# Altium schematic sheet A3000_Backplane.SchDoc
size A3; SheetNumber: 1; SheetTotal: 1
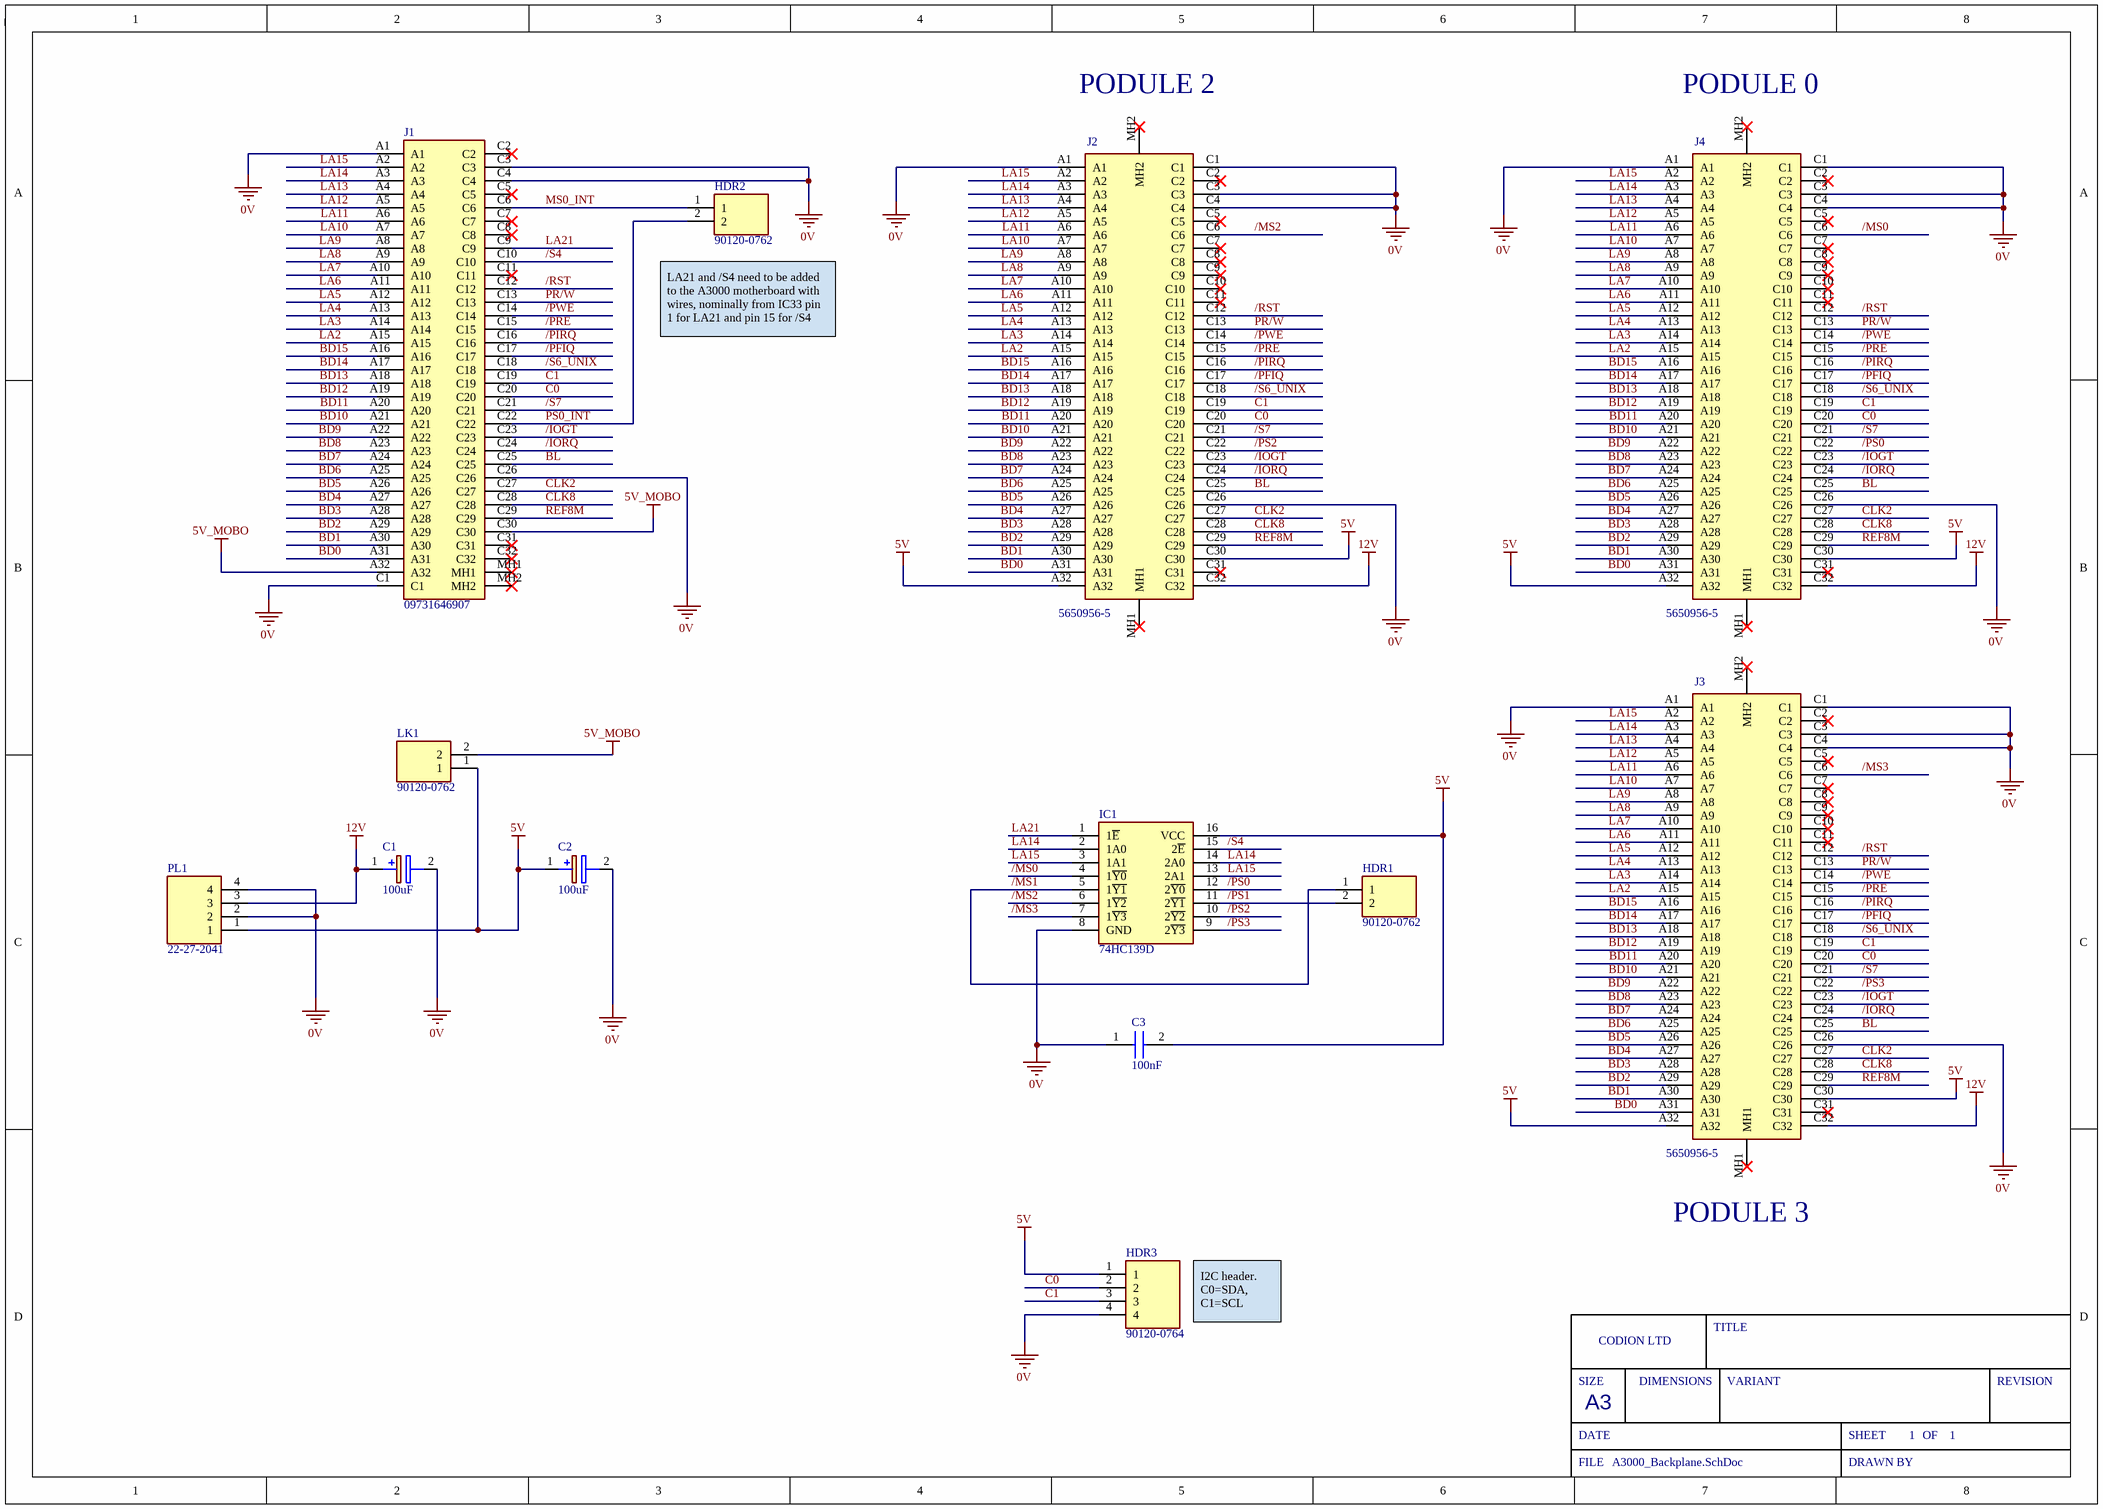
[diagram p0: A3000_Backplane.SchDoc]

## Parts
C1  100uF  [EEE0JA331XP]
C2  100uF  [EEE0JA331XP]
C3  100nF  [CAPC2012X145N]
HDR1  90120-0762  [HDRV2W35P0X254_1X2_508X249X560P]
HDR2  90120-0762  [HDRV2W35P0X254_1X2_508X249X560P]
HDR3  90120-0764  [HDRV4W90P0X254_1X4_994X249X560P]
IC1  74HC139D  [SOIC127P600X175-16N]
J1  09731646907  [56509455]
J2  5650956-5  [56509565]
J3  5650956-5  [56509565]
J4  5650956-5  [56509565]
LK1  90120-0762  [HDRV2W35P0X254_1X2_508X249X560P]
PL1  22-27-2041  [SHDR4W64P0X254_1X4_1016X580X1170P]

## Nets
0V: C1.2(-) C2.2(-) C3.1 HDR3.4 IC1.8(GND) J1.A1 J1.C1 J1.C3 J1.C4 J1.C26 J2.A1 J2.C1 J2.C3 J2.C4 J2.C26 J3.A1 J3.C1 J3.C3 J3.C4 J3.C26 J4.A1 J4.C1 J4.C3 J4.C4 J4.C26 PL1.2 PL1.4
5V: C2.1(+) C3.2 HDR3.1 IC1.16(VCC) J2.A32 J2.C30 J3.A32 J3.C30 J4.A32 J4.C30 LK1.1 PL1.1
5V_MOBO: J1.A32 J1.C30 LK1.2
12V: C1.1(+) J2.C32 J3.C32 J4.C32 PL1.3
/IOGT: J1.C23 J2.C23 J3.C23 J4.C23
/IORQ: J1.C24 J2.C24 J3.C24 J4.C24
/MS0: IC1.4(1~{Y0}) J4.C6
/MS1: HDR1.1 IC1.5(1~{Y1})
/MS2: IC1.6(1~{Y2}) J2.C6
/MS3: IC1.7(1~{Y3}) J3.C6
/PFIQ: J1.C17 J2.C17 J3.C17 J4.C17
/PIRQ: J1.C16 J2.C16 J3.C16 J4.C16
/PRE: J1.C15 J2.C15 J3.C15 J4.C15
/PS0: IC1.12(2~{Y0}) J4.C22
/PS1: HDR1.2 IC1.11(2~{Y1})
/PS2: IC1.10(2~{Y2}) J2.C22
/PS3: IC1.9(2~{Y3}) J3.C22
/PWE: J1.C14 J2.C14 J3.C14 J4.C14
/RST: J1.C12 J2.C12 J3.C12 J4.C12
/S4: IC1.15(2~{E}) J1.C10
/S6_UNIX: J1.C18 J2.C18 J3.C18 J4.C18
/S7: J1.C21 J2.C21 J3.C21 J4.C21
BD0: J1.A31 J2.A31 J3.A31 J4.A31
BD1: J1.A30 J2.A30 J3.A30 J4.A30
BD2: J1.A29 J2.A29 J3.A29 J4.A29
BD3: J1.A28 J2.A28 J3.A28 J4.A28
BD4: J1.A27 J2.A27 J3.A27 J4.A27
BD5: J1.A26 J2.A26 J3.A26 J4.A26
BD6: J1.A25 J2.A25 J3.A25 J4.A25
BD7: J1.A24 J2.A24 J3.A24 J4.A24
BD8: J1.A23 J2.A23 J3.A23 J4.A23
BD9: J1.A22 J2.A22 J3.A22 J4.A22
BD10: J1.A21 J2.A21 J3.A21 J4.A21
BD11: J1.A20 J2.A20 J3.A20 J4.A20
BD12: J1.A19 J2.A19 J3.A19 J4.A19
BD13: J1.A18 J2.A18 J3.A18 J4.A18
BD14: J1.A17 J2.A17 J3.A17 J4.A17
BD15: J1.A16 J2.A16 J3.A16 J4.A16
BL: J1.C25 J2.C25 J3.C25 J4.C25
C0: HDR3.2 J1.C20 J2.C20 J3.C20 J4.C20
C1: HDR3.3 J1.C19 J2.C19 J3.C19 J4.C19
CLK2: J1.C27 J2.C27 J3.C27 J4.C27
CLK8: J1.C28 J2.C28 J3.C28 J4.C28
LA2: J1.A15 J2.A15 J3.A15 J4.A15
LA3: J1.A14 J2.A14 J3.A14 J4.A14
LA4: J1.A13 J2.A13 J3.A13 J4.A13
LA5: J1.A12 J2.A12 J3.A12 J4.A12
LA6: J1.A11 J2.A11 J3.A11 J4.A11
LA7: J1.A10 J2.A10 J3.A10 J4.A10
LA8: J1.A9 J2.A9 J3.A9 J4.A9
LA9: J1.A8 J2.A8 J3.A8 J4.A8
LA10: J1.A7 J2.A7 J3.A7 J4.A7
LA11: J1.A6 J2.A6 J3.A6 J4.A6
LA12: J1.A5 J2.A5 J3.A5 J4.A5
LA13: J1.A4 J2.A4 J3.A4 J4.A4
LA14: IC1.2(1A0) IC1.14(2A0) J1.A3 J2.A3 J3.A3 J4.A3
LA15: IC1.3(1A1) IC1.13(2A1) J1.A2 J2.A2 J3.A2 J4.A2
LA21: IC1.1(1~{E}) J1.C9
MS0_INT: HDR2.1 J1.C6
PR/W: J1.C13 J2.C13 J3.C13 J4.C13
PS0_INT: HDR2.2 J1.C22
REF8M: J1.C29 J2.C29 J3.C29 J4.C29

Not connected (* = marked no-connect by the designer): J1 C2* C5* C7* C8* C11* C31* C32* MH1* MH2*; J2 C2* C5* C7* C8* C9* C10* C11* C31* MH1* MH2*; J3 C2* C5* C7* C8* C9* C10* C11* C31* MH1* MH2*; J4 C2* C5* C7* C8* C9* C10* C11* C31* MH1* MH2*

## Notes on the sheet
- (near J2) PODULE 2
- (near J4) PODULE 0
- (near HDR2) LA21 and /S4 need to be added to the A3000 motherboard with wires, nominally from IC33 pin 1 for LA21 and pin 15 for /S4
- PODULE 3
- I2C header.
  C0=SDA, C1=SCL
- SIZE
- CODION LTD
- DIMENSIONS
- TITLE
- VARIANT
- REVISION
- DATE
- A3
- SHEET
- OF
- FILE
- DRAWN BY

## Library data of the parts
C1 C2 = EEE-TC1C101XP: Capacitor Polarised; Manufacturer_Name: Panasonic; Datasheet Link: http://industrial.panasonic.com/cdbs/www-data/pdf/RDE0000/ABA0000C678.pdf; Height: 7.8mm; Manufacturer_Part_Number: EEE-TC1C101XP; Mouser Part Number: 667-EEE-TC1C101XP; Mouser Price/Stock: https://www.mouser.co.uk/ProductDetail/Panasonic/EEE-TC1C101XP?qs=367PjNmvCmntb8uQ4S3WYg%3D%3D; Arrow Part Number: EEE-TC1C101XP; Arrow Price/Stock: https://www.arrow.com/en/products/eee-tc1c101xp/panasonic
C3 = C2012X7R2A104K125AA: Capacitor; Manufacturer_Name: TDK; Datasheet Link: https://product.tdk.com/info/en/catalog/datasheets/mlcc_commercial_midvoltage_en.pdf; Height: 1.45mm; Manufacturer_Part_Number: C2012X7R2A104K125AA; Mouser Part Number: 810-C2012X7R2A104K; Mouser Price/Stock: https://www.mouser.co.uk/ProductDetail/TDK/C2012X7R2A104K125AA?qs=NRhsANhppD9J0ZsT2%2Fo%2F7Q%3D%3D; Arrow Part Number: C2012X7R2A104K125AA; Arrow Price/Stock: https://www.arrow.com/en/products/c2012x7r2a104k125aa/tdk
HDR1 HDR2 LK1 = 90120-0762: Connector; Manufacturer_Name: Molex; Datasheet Link: http://www.molex.com/pdm_docs/sd/901200762_sd.pdf; Height: 5.6mm; Manufacturer_Part_Number: 90120-0762; Mouser Part Number: 538-90120-0762; Mouser Price/Stock: https://www.mouser.co.uk/ProductDetail/Molex/90120-0762?qs=NKHyz0HolODkarWFh2VFww%3D%3D; Arrow Part Number: 90120-0762; Arrow Price/Stock: https://www.arrow.com/en/products/90120-0762/molex?region=nac
HDR3 = 90120-0764: Connector; Manufacturer_Name: Molex; Datasheet Link: https://www.molex.com/webdocs/datasheets/pdf/en-us/0901200764_PCB_HEADERS.pdf; Height: 5.6mm; Manufacturer_Part_Number: 90120-0764; Mouser Part Number: 538-90120-0764; Mouser Price/Stock: https://www.mouser.co.uk/ProductDetail/Molex/90120-0764?qs=QSnLD11VNirsMTdnHEPG3Q%3D%3D
IC1 = 74HC139D: Integrated Circuit; Manufacturer_Name: Nexperia; Datasheet Link: https://componentsearchengine.com/Datasheets/2/74HC139D.pdf; Height: 1.75mm; Manufacturer_Part_Number: 74HC139D; Mouser Part Number: 771-74HC139D; Mouser Price/Stock: https://www.mouser.co.uk/ProductDetail/Nexperia/74HC139D?qs=KBAwV6Cvgt1hUs7HUiOTFA%3D%3D
J1 = 5650945-5: Connector
J2-J4 = 5650956-5: Connector; Manufacturer_Name: TE Connectivity; Datasheet Link: https://componentsearchengine.com/Datasheets/2/5650956-5.pdf; Height: 11.51mm; Manufacturer_Part_Number: 5650956-5; Mouser Part Number: 571-5650956-5; Mouser Price/Stock: https://www.mouser.co.uk/ProductDetail/TE-Connectivity/5650956-5?qs=U4pz39agNJCw%2F9%252BN9Cdy%2Fg%3D%3D
PL1 = 22-27-2041: Connector; Manufacturer_Name: Molex; Datasheet Link: https://www.molex.com/pdm_docs/sd/022272041_sd.pdf; Height: 11.7mm; Manufacturer_Part_Number: 22-27-2041; Mouser Part Number: 538-22-27-2041; Mouser Price/Stock: https://www.mouser.co.uk/ProductDetail/Molex/22-27-2041?qs=hSmm4fxMIuMKVUQkn4wbYQ%3D%3D